# EAGLE design IR_rec (EAGLE 5.11)
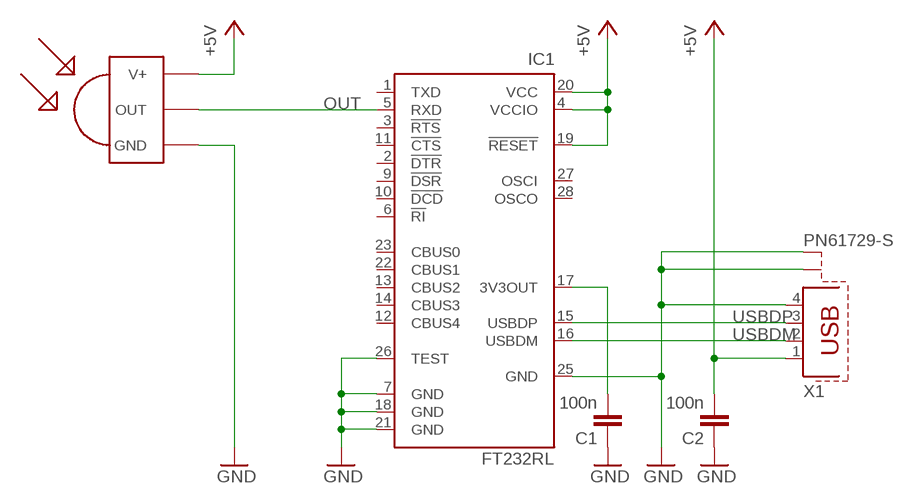
[diagram p0: schematic, sheet 1]

## Parts
C1  100n  C-EUC0805  [C0805]
C2  100n  C-EUC0805  [C0805]
IC1  FT232RL  [SSOP28]
U$1  TSOP1836  [TSOP18XX]
X1  PN61729-S  [PN61729-S]

## Nets
+5V: C2.2 IC1.4(VCCIO) IC1.19(!RESET) IC1.20(VCC) U$1.VCC(V+) X1.1
GND: C1.1 C2.1 IC1.7(GND) IC1.18(GND) IC1.21(GND) IC1.25(GND) IC1.26(TEST) U$1.GND X1.4 X1.S1 X1.S2
N$6: C1.2 IC1.17(3V3OUT)
OUT: IC1.5(RXD) U$1.OUT
USBDM: IC1.16(USBDM) X1.2
USBDP: IC1.15(USBDP) X1.3
Unconnected: IC1.1(TXD) IC1.2(!DTR) IC1.3(!RTS) IC1.6(!RI) IC1.9(!DSR) IC1.10(!DCD) IC1.11(!CTS) IC1.12(CBUS4) IC1.13(CBUS2) IC1.14(CBUS3) IC1.22(CBUS1) IC1.23(CBUS0) IC1.27(OSCI) IC1.28(OSCO)

## Library data of the parts
C1 C2 = rcl:C-EU: CAPACITOR, European symbol
IC1 = ftdichip:FT232R: Source: http://www.ftdichip.com/Documents/DataSheets/DS_FT232R_v104.pdf; MPN: FT232RL; OC_FARNELL: 1146032; OC_NEWARK: 91K9918
U$1 = tsop:TSOP1836: IR Receiver and Demodulator
X1 = con-berg:PN61729-S: BERG USB connector; OC_FARNELL: unknown; OC_NEWARK: unknown

## Board
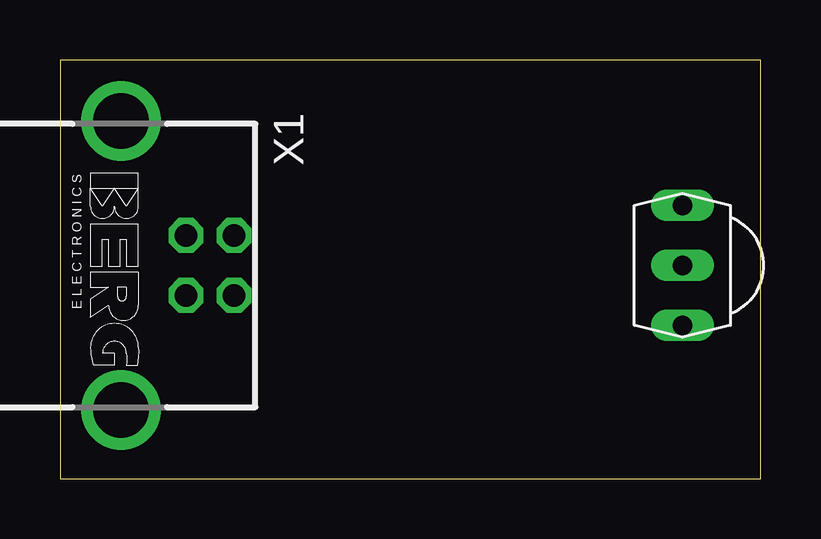
[diagram p1: board, top side]
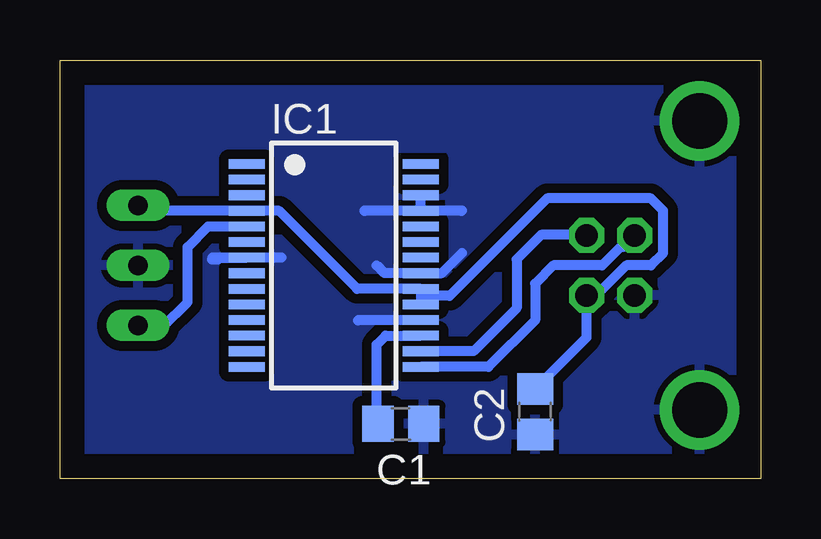
[diagram p2: board, bottom side, seen from below]

Size 29.19 x 17.45 mm. Coordinates in mm from the lower left corner, seen from the top.
Outline: 0,0 29.19,0 29.19,17.45 0,17.45 0,0
Copper layers (1*16): Top 0.035mm / dielectric 1.5mm / Bottom 0.035mm
Design rules "default": minimum track width 10mil, minimum drill 24mil, track to track 8mil, track to pad 8mil, pad to pad 8mil, via to via 8mil, smd to smd 8mil, copper to edge 40mil, drill to drill 8mil, minimum pad ring 10mil, minimum via ring 8mil, stop-mask expansion 4mil, vias tented up to drill 0mil, thermal gap 10mil

### Footprints (pad centres in the part's own frame; a part is rotated, then mirrored left to right if it is on the bottom)
C0805 = smd 1.3 x 1.5: 1 -0.95,0; 2 0.95,0
SSOP28 = smd 0.4 x 1.5: 1 -4.225,-3.625; 2 -3.575,-3.625; 3 -2.925,-3.625; 4 -2.275,-3.625; 5 -1.625,-3.625; 6 -0.975,-3.625; 7 -0.325,-3.625; 8 0.325,-3.625; 9 0.975,-3.625; 10 1.625,-3.625; 11 2.275,-3.625; 12 2.925,-3.625; 13 3.575,-3.625; 14 4.225,-3.625; 15 4.225,3.625; 16 3.575,3.625; 17 2.925,3.625; 18 2.275,3.625; 19 1.625,3.625; 20 0.975,3.625; 21 0.325,3.625; 22 -0.325,3.625; 23 -0.975,3.625; 24 -1.625,3.625; 25 -2.275,3.625; 26 -2.925,3.625; 27 -3.575,3.625; 28 -4.225,3.625
TSOP18XX = drill 0.813 long: GND -0.001,-0.027; OUT -2.501,-0.027; VCC 2.499,-0.027
PN61729-S = drill 0.95 octagon: 1 1.25,4.71; 2 -1.25,4.71; 3 -1.25,2.71; 4 1.25,2.71 | drill 2.3 pad 2.9: S1 -6.02,0; S2 6.02,0

### Placement (x,y rotation side)
C1  14.99,2.29 180 bottom
C2  9.4,2.79 90 bottom
IC1  17.78,8.89 270 bottom
U$1  25.91,8.89 90 top
X1  2.54,8.89 270 top

### Tracks (layer width: path | path; a pad name or v marks a point on that pad's centre or on a via)
+5V
  Bottom 0.406: IC1.20 IC1.19 | IC1.20 13.86,7.62 12.95,7.62 8.89,11.68 4.57,11.68 4.06,11.18 4.06,9.4 4.57,8.89 5.59,8.89 6.84,7.64 X1.1 7.25,5.89 C2.2 | IC1.20 16.8,7.92 20.05,11.16 IC1.4 25.71,11.16 U$1.VCC
GND
  Bottom 0.406: 12.45,11.18 12.46,11.16 IC1.25 | 16,8.89 15.68,8.56 IC1.21 13.28,8.56 12.45,9.4 | IC1.18 16.75,6.62 16.76,6.6 | IC1.7 22.79,9.21 22.86,9.14 22.76,9.14 | 22.76,9.14 22.61,9.14 | 22.76,9.14 22.84,9.22 19.96,9.22 | IC1.25 16.5,11.16 16.51,11.18 | IC1.25 IC1.26
  pour Bottom (isolate 0.406): 0,17.53 29.21,17.53 29.21,0 29.46,-0.25 0,-0.25
N$1
  pour Bottom (no thermals): 5.33,16.76 20.83,16.76 20.83,13.97 18.29,13.72 18.29,13.46 15.49,13.46 15.49,13.72 5.33,13.72
N$6
  Bottom 0.406: IC1.17 15.62,5.96 16,5.59 16,2.35 C1.2
OUT
  Bottom 0.406: IC1.5 23.01,10.52 23.88,9.65 23.88,7.37 24.89,6.35 25.9,6.35 U$1.OUT
USBDM
  Bottom 0.406: IC1.16 11.96,5.32 10.16,7.11 10.16,9.14 9.14,10.16 7.27,10.16 X1.2
USBDP
  Bottom 0.406: IC1.15 11.34,4.67 9.4,6.6 9.4,8.13 8.64,8.89 6.6,8.89 5.84,9.65 5.74,9.65 X1.3

### Text on the board
bRestrict: IR_rec V1